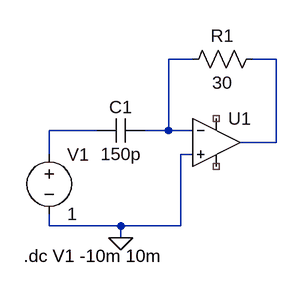
[diagram p0: schematic Draft3.asc]
Draft3.asc, the LTspice schematic file:
Version 4
SHEET 1 880 680
WIRE 128 48 96 48
WIRE 240 48 208 48
WIRE 0 144 -64 144
WIRE 96 144 96 48
WIRE 96 144 64 144
WIRE 128 144 96 144
WIRE 240 160 240 48
WIRE 240 160 192 160
WIRE -64 176 -64 144
WIRE 128 176 112 176
WIRE -64 272 -64 256
WIRE 32 272 -64 272
WIRE 112 272 112 176
WIRE 112 272 32 272
WIRE 32 288 32 272
FLAG 32 288 0
SYMBOL OpAmps\\UniversalOpAmp2 160 160 R0
SYMATTR InstName U1
SYMBOL cap 64 128 R90
WINDOW 0 0 32 VBottom 2
WINDOW 3 32 32 VTop 2
SYMATTR InstName C1
SYMATTR Value 150p
SYMBOL res 224 32 R90
WINDOW 0 0 56 VBottom 2
WINDOW 3 32 56 VTop 2
SYMATTR InstName R1
SYMATTR Value 30
SYMBOL voltage -64 160 R0
WINDOW 123 0 0 Left 0
WINDOW 39 0 0 Left 0
SYMATTR InstName V1
SYMATTR Value 1
TEXT -98 312 Left 2 !.dc V1 -10m 10m

The netlist it stands for:
* Draft3.asc
XU1 0 N001 NC_01 NC_02 N002 level2 Avol=1Meg GBW=10Meg Slew=10Meg Ilimit=25m Rail=0 Vos=0 En=0 Enk=0 In=0 Ink=0 Rin=500Meg  ; pins In+ In- V+ V- OUT
C1 N001 N003 150p
R1 N002 N001 30
V1 N003 0 1
.dc V1 -10m 10m
.lib UniversalOpAmp2.lib
.backanno
.end